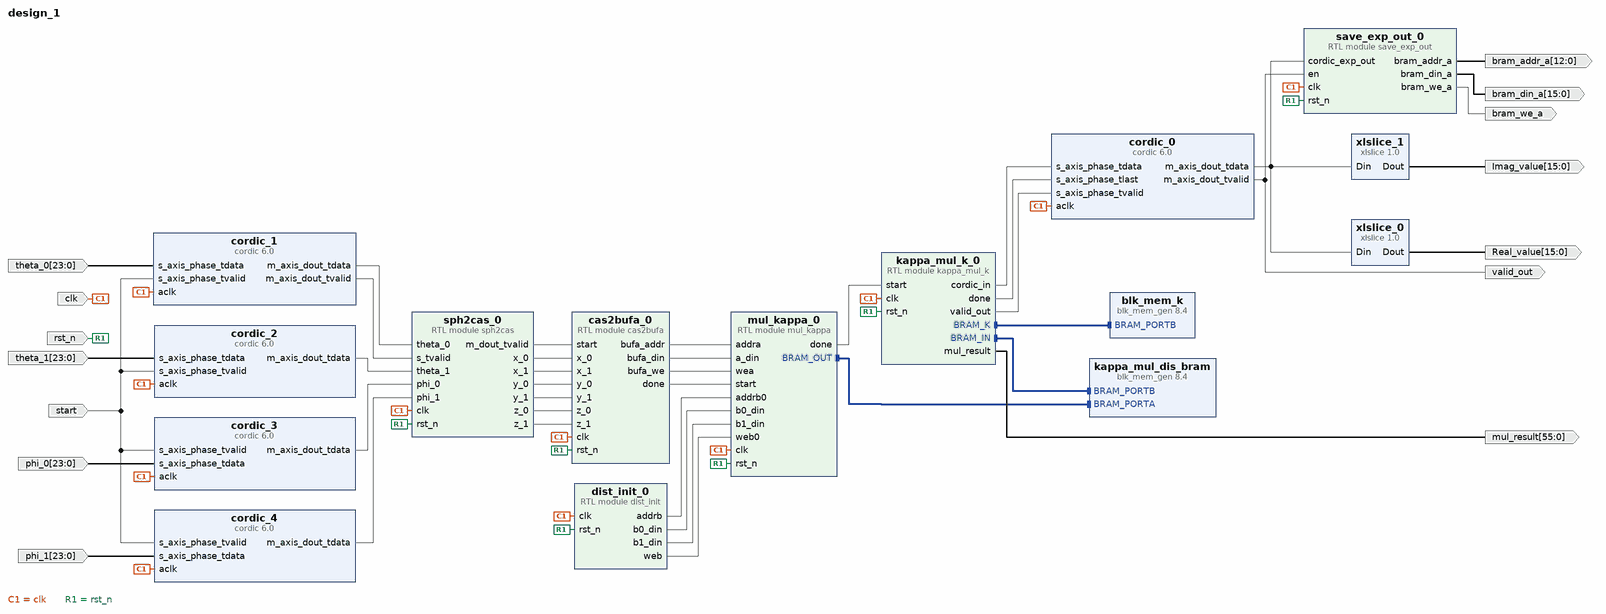
[diagram p0: block diagram of the top level]
# Vivado block design design_1, xck26-sfvc784-2LV-c, Vivado 2024.2
create_bd_design design_1

create_bd_port -dir I -type clk clk
set_property -dict {CONFIG.FREQ_HZ 100000000} [get_bd_ports clk]
create_bd_port -dir I rst_n
create_bd_port -dir I start
create_bd_port -dir O valid_out
create_bd_port -dir O -from 15 -to 0 Real_value
create_bd_port -dir O -from 15 -to 0 Imag_value
create_bd_port -dir O -from 55 -to 0 mul_result
create_bd_port -dir I -from 23 -to 0 theta_0
create_bd_port -dir I -from 23 -to 0 theta_1
create_bd_port -dir I -from 23 -to 0 phi_0
create_bd_port -dir I -from 23 -to 0 phi_1
create_bd_port -dir O -from 15 -to 0 bram_din_a
create_bd_port -dir O bram_we_a
create_bd_port -dir O -from 12 -to 0 bram_addr_a

create_bd_cell -type ip -vlnv xilinx.com:ip:blk_mem_gen:8.4 kappa_mul_dis_bram
set_property -dict [list \
  CONFIG.Coe_File ../../../../../../mem_init.coe \
  CONFIG.Load_Init_File true \
  CONFIG.Memory_Type True_Dual_Port_RAM \
  CONFIG.Use_RSTA_Pin true \
  CONFIG.Use_RSTB_Pin true \
  CONFIG.Write_Depth_A 16 \
  CONFIG.Write_Width_A 32 \
  CONFIG.use_bram_block Stand_Alone \
] [get_bd_cells kappa_mul_dis_bram]
create_bd_cell -type ip -vlnv xilinx.com:ip:blk_mem_gen:8.4 blk_mem_k
set_property -dict [list \
  CONFIG.Coe_File ../../../../../../bram_k_init.coe \
  CONFIG.Load_Init_File true \
  CONFIG.Memory_Type True_Dual_Port_RAM \
  CONFIG.Use_RSTA_Pin true \
  CONFIG.Use_RSTB_Pin true \
  CONFIG.Write_Depth_A 258 \
  CONFIG.Write_Width_A 24 \
  CONFIG.use_bram_block Stand_Alone \
] [get_bd_cells blk_mem_k]
create_bd_cell -type module -reference kappa_mul_k kappa_mul_k_0
create_bd_cell -type ip -vlnv xilinx.com:ip:cordic:6.0 cordic_0
set_property -dict [list \
  CONFIG.Data_Format SignedFraction \
  CONFIG.Functional_Selection Sin_and_Cos \
  CONFIG.Input_Width 24 \
  CONFIG.Output_Width 16 \
  CONFIG.Phase_Format Scaled_Radians \
  CONFIG.out_tlast_behv Pass_Phase_TLAST \
  CONFIG.phase_has_tlast true \
] [get_bd_cells cordic_0]
create_bd_cell -type ip -vlnv xilinx.com:ip:xlslice:1.0 xlslice_0
set_property -dict {CONFIG.DIN_FROM 15} [get_bd_cells xlslice_0]
create_bd_cell -type ip -vlnv xilinx.com:ip:xlslice:1.0 xlslice_1
set_property -dict {CONFIG.DIN_FROM 31 CONFIG.DIN_TO 16} [get_bd_cells xlslice_1]
create_bd_cell -type module -reference mul_kappa mul_kappa_0
create_bd_cell -type module -reference cas2bufa cas2bufa_0
create_bd_cell -type module -reference dist_init dist_init_0
create_bd_cell -type module -reference sph2cas sph2cas_0
create_bd_cell -type ip -vlnv xilinx.com:ip:cordic:6.0 cordic_1
set_property -dict [list \
  CONFIG.Data_Format SignedFraction \
  CONFIG.Functional_Selection Sin_and_Cos \
  CONFIG.Input_Width 24 \
  CONFIG.Output_Width 16 \
] [get_bd_cells cordic_1]
create_bd_cell -type ip -vlnv xilinx.com:ip:cordic:6.0 cordic_2
set_property -dict [list \
  CONFIG.Data_Format SignedFraction \
  CONFIG.Functional_Selection Sin_and_Cos \
  CONFIG.Input_Width 24 \
  CONFIG.Output_Width 16 \
] [get_bd_cells cordic_2]
create_bd_cell -type ip -vlnv xilinx.com:ip:cordic:6.0 cordic_3
set_property -dict [list \
  CONFIG.Compensation_Scaling No_Scale_Compensation \
  CONFIG.Data_Format SignedFraction \
  CONFIG.Functional_Selection Sin_and_Cos \
  CONFIG.Input_Width 24 \
  CONFIG.Output_Width 16 \
] [get_bd_cells cordic_3]
create_bd_cell -type ip -vlnv xilinx.com:ip:cordic:6.0 cordic_4
set_property -dict [list \
  CONFIG.Data_Format SignedFraction \
  CONFIG.Functional_Selection Sin_and_Cos \
  CONFIG.Input_Width 24 \
  CONFIG.Output_Width 16 \
] [get_bd_cells cordic_4]
create_bd_cell -type module -reference save_exp_out save_exp_out_0

# ---- connections ----

connect_bd_intf_net [get_bd_intf_pins kappa_mul_dis_bram/BRAM_PORTB] [get_bd_intf_pins kappa_mul_k_0/BRAM_IN]
connect_bd_intf_net [get_bd_intf_pins blk_mem_k/BRAM_PORTB] [get_bd_intf_pins kappa_mul_k_0/BRAM_K]
connect_bd_intf_net [get_bd_intf_pins mul_kappa_0/BRAM_OUT] [get_bd_intf_pins kappa_mul_dis_bram/BRAM_PORTA]
connect_bd_net [get_bd_pins cas2bufa_0/bufa_addr] [get_bd_pins mul_kappa_0/addra]
connect_bd_net [get_bd_pins cas2bufa_0/bufa_din] [get_bd_pins mul_kappa_0/a_din]
connect_bd_net [get_bd_pins cas2bufa_0/bufa_we] [get_bd_pins mul_kappa_0/wea]
connect_bd_net [get_bd_pins cas2bufa_0/done] [get_bd_pins mul_kappa_0/start]
connect_bd_net [get_bd_ports clk] \
  [get_bd_pins cordic_0/aclk] [get_bd_pins dist_init_0/clk] [get_bd_pins cordic_1/aclk] [get_bd_pins cordic_2/aclk] \
  [get_bd_pins cordic_3/aclk] [get_bd_pins cordic_4/aclk] [get_bd_pins mul_kappa_0/clk] [get_bd_pins cas2bufa_0/clk] \
  [get_bd_pins sph2cas_0/clk] [get_bd_pins save_exp_out_0/clk] [get_bd_pins kappa_mul_k_0/clk]
connect_bd_net [get_bd_pins cordic_0/m_axis_dout_tdata] \
  [get_bd_pins xlslice_1/Din] [get_bd_pins xlslice_0/Din] [get_bd_pins save_exp_out_0/cordic_exp_out]
connect_bd_net [get_bd_pins cordic_0/m_axis_dout_tvalid] [get_bd_ports valid_out] [get_bd_pins save_exp_out_0/en]
connect_bd_net [get_bd_pins cordic_1/m_axis_dout_tdata] [get_bd_pins sph2cas_0/theta_0]
connect_bd_net [get_bd_pins cordic_1/m_axis_dout_tvalid] [get_bd_pins sph2cas_0/s_tvalid]
connect_bd_net [get_bd_pins cordic_2/m_axis_dout_tdata] [get_bd_pins sph2cas_0/theta_1]
connect_bd_net [get_bd_pins cordic_3/m_axis_dout_tdata] [get_bd_pins sph2cas_0/phi_0]
connect_bd_net [get_bd_pins cordic_4/m_axis_dout_tdata] [get_bd_pins sph2cas_0/phi_1]
connect_bd_net [get_bd_pins dist_init_0/addrb] [get_bd_pins mul_kappa_0/addrb0]
connect_bd_net [get_bd_pins dist_init_0/b0_din] [get_bd_pins mul_kappa_0/b0_din]
connect_bd_net [get_bd_pins dist_init_0/b1_din] [get_bd_pins mul_kappa_0/b1_din]
connect_bd_net [get_bd_pins dist_init_0/web] [get_bd_pins mul_kappa_0/web0]
connect_bd_net [get_bd_pins kappa_mul_k_0/cordic_in] [get_bd_pins cordic_0/s_axis_phase_tdata]
connect_bd_net [get_bd_pins kappa_mul_k_0/done] [get_bd_pins cordic_0/s_axis_phase_tlast]
connect_bd_net [get_bd_pins kappa_mul_k_0/mul_result] [get_bd_ports mul_result]
connect_bd_net [get_bd_pins kappa_mul_k_0/valid_out] [get_bd_pins cordic_0/s_axis_phase_tvalid]
connect_bd_net [get_bd_pins mul_kappa_0/done] [get_bd_pins kappa_mul_k_0/start]
connect_bd_net -net phi_0_1 [get_bd_ports phi_0] [get_bd_pins cordic_3/s_axis_phase_tdata]
connect_bd_net -net phi_1_1 [get_bd_ports phi_1] [get_bd_pins cordic_4/s_axis_phase_tdata]
connect_bd_net [get_bd_ports rst_n] \
  [get_bd_pins dist_init_0/rst_n] [get_bd_pins mul_kappa_0/rst_n] [get_bd_pins cas2bufa_0/rst_n] \
  [get_bd_pins sph2cas_0/rst_n] [get_bd_pins save_exp_out_0/rst_n] [get_bd_pins kappa_mul_k_0/rst_n]
connect_bd_net [get_bd_pins save_exp_out_0/bram_addr_a] [get_bd_ports bram_addr_a]
connect_bd_net [get_bd_pins save_exp_out_0/bram_din_a] [get_bd_ports bram_din_a]
connect_bd_net [get_bd_pins save_exp_out_0/bram_we_a] [get_bd_ports bram_we_a]
connect_bd_net [get_bd_pins sph2cas_0/m_dout_tvalid] [get_bd_pins cas2bufa_0/start]
connect_bd_net [get_bd_pins sph2cas_0/x_0] [get_bd_pins cas2bufa_0/x_0]
connect_bd_net [get_bd_pins sph2cas_0/x_1] [get_bd_pins cas2bufa_0/x_1]
connect_bd_net [get_bd_pins sph2cas_0/y_0] [get_bd_pins cas2bufa_0/y_0]
connect_bd_net [get_bd_pins sph2cas_0/y_1] [get_bd_pins cas2bufa_0/y_1]
connect_bd_net [get_bd_pins sph2cas_0/z_0] [get_bd_pins cas2bufa_0/z_0]
connect_bd_net [get_bd_pins sph2cas_0/z_1] [get_bd_pins cas2bufa_0/z_1]
connect_bd_net [get_bd_ports start] \
  [get_bd_pins cordic_1/s_axis_phase_tvalid] [get_bd_pins cordic_2/s_axis_phase_tvalid] \
  [get_bd_pins cordic_3/s_axis_phase_tvalid] [get_bd_pins cordic_4/s_axis_phase_tvalid]
connect_bd_net -net theta_0_1 [get_bd_ports theta_0] [get_bd_pins cordic_1/s_axis_phase_tdata]
connect_bd_net -net theta_1_1 [get_bd_ports theta_1] [get_bd_pins cordic_2/s_axis_phase_tdata]
connect_bd_net [get_bd_pins xlslice_0/Dout] [get_bd_ports Real_value]
connect_bd_net [get_bd_pins xlslice_1/Dout] [get_bd_ports Imag_value]

validate_bd_design
save_bd_design
